# EAGLE design humanoid-16 (EAGLE 7.2.0)

## Sheet 1 of 10
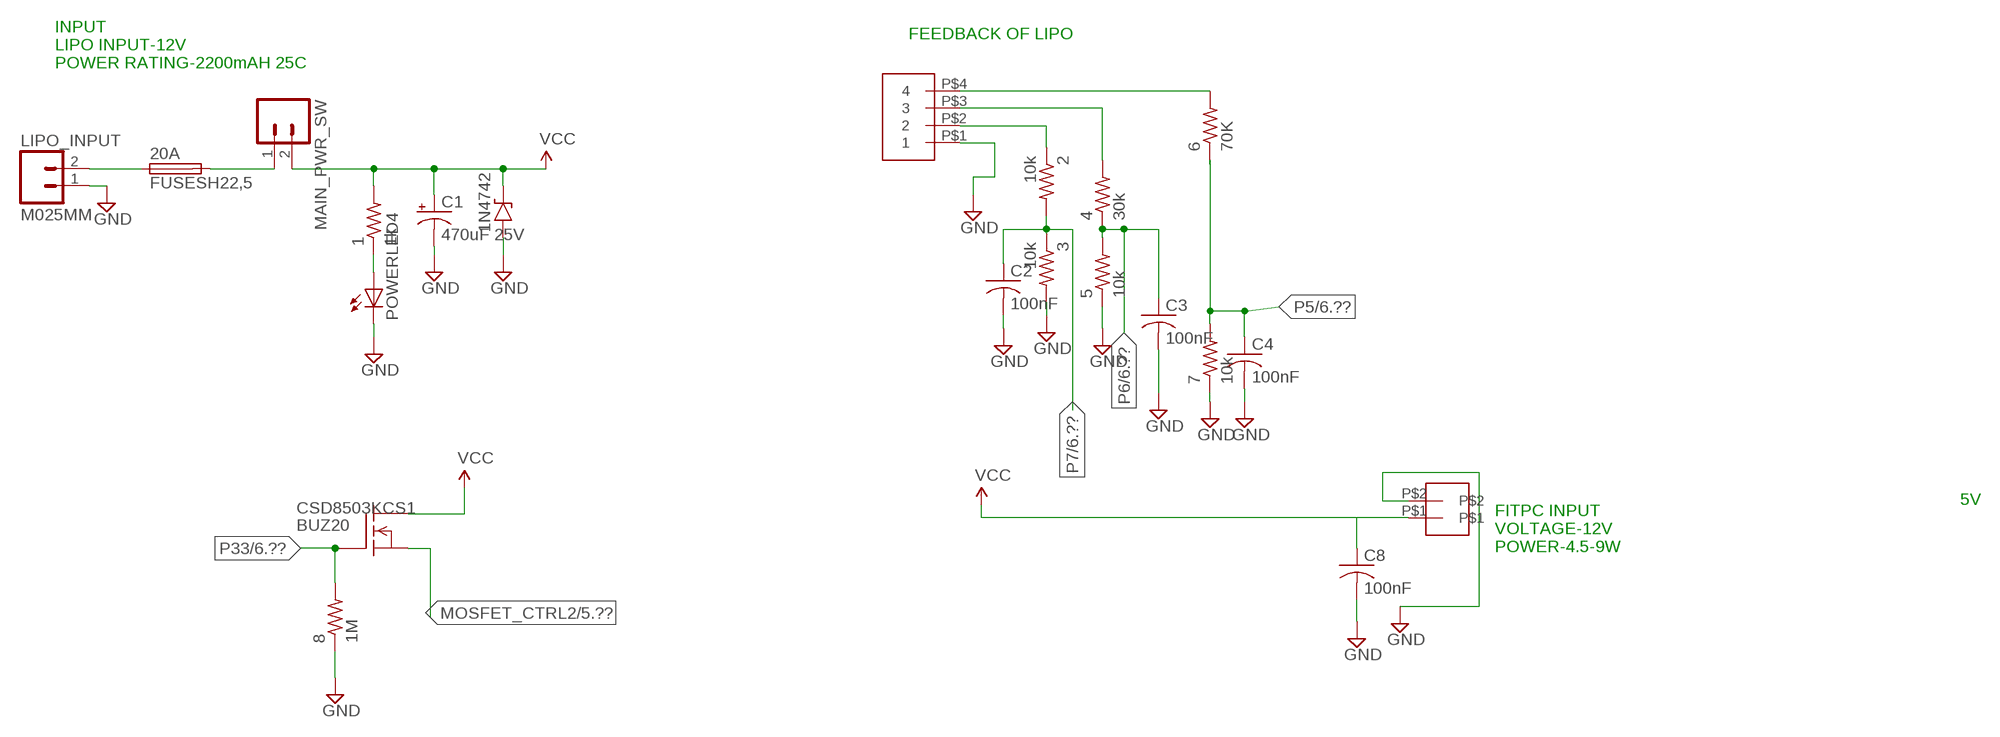
[diagram p0: schematic, sheet 1]

### Parts
1  1k  R-US_R0805  [R0805]
1N4742  1N47XX3  [DO41-3]
2  10k  R-US_R0805  [R0805]
3  10k  R-US_R0805  [R0805]
4  30k  R-US_R0805  [R0805]
5  10k  R-US_R0805  [R0805]
6  70K  R-US_R0805  [R0805]
7  10k  R-US_R0805  [R0805]
8  1M  R-US_R0805  [R0805]
20A  FUSESH22,5  [SH22,5]
C1  470uF 25V  CPOL-USG  [PANASONIC_G]
C2  100nF  C-USC1206  [C1206]
C3  100nF  C-USC1206  [C1206]
C4  100nF  C-USC1206  [C1206]
C8  100nF  C-USC1206  [C1206]
CSD8503KCS1  BUZ20  [TO220]
FITPC  2PINRIGHT  [2PINRIGHT]
LIPO_INPUT  M025MM  [SCREWTERMINAL-5MM-2]
MAIN_PWR_SW  M02PTH  [1X02]
POWERLED4  LEDCHIPLED_1206  [CHIPLED_1206]
U$2  4PINRIGHT  [4PINRIGHT]

### Nets
GND: 1N4742.A 3.2 5.1 7.1 8.1 C1.- C2.2 C3.2 C4.2 C8.2 FITPC.P$2 LIPO_INPUT.1 POWERLED4.C U$2.P$1 ; also sheet 2,3,5,6,7,8,10
LIPO_FB4: 6.2 U$2.P$4
MOSFET_CTRL2: CSD8503KCS1.3(S) ; also sheet 5
N$4: 2.1 U$2.P$2
N$9: 20A.2 MAIN_PWR_SW.1
N$14: 20A.1 LIPO_INPUT.2
N$338: 4.2 U$2.P$3
N$381: 1.1 POWERLED4.A
P5: 6.1 7.2 C4.1 ; also sheet 6
P6: 4.1 5.2 C3.1 ; also sheet 6
P7: 2.2 3.1 C2.1 ; also sheet 6
P33: 8.2 CSD8503KCS1.1(G) ; also sheet 6
VCC: 1.2 1N4742.C C1.+ C8.1 CSD8503KCS1.2(D) FITPC.P$1 MAIN_PWR_SW.2 ; also sheet 3

### Notes on the sheet
- FEEDBACK OF LIPO
- INPUT
  LIPO INPUT-12V
  POWER RATING-2200mAH 25C
- 5V
- FITPC INPUT
  VOLTAGE-12V
  POWER-4.5-9W

## Sheet 2 of 10
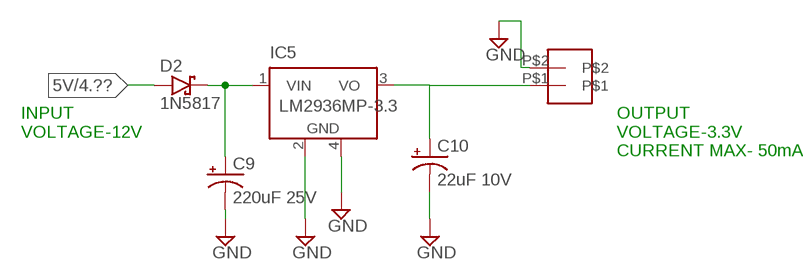
[diagram p1: schematic, sheet 2]

### Parts
3.3V1  2PINRIGHT  [2PINRIGHT]
C9  220uF 25V  CPOL-USG  [PANASONIC_G]
C10  22uF 10V  CPOL-USB  [PANASONIC_B]
D2  1N5817  [DO41-3]
IC5  LM2936MP-3.3  [SOT223]

### Nets
3.3V: 3.3V1.P$1 C10.+ IC5.3(VO) ; also sheet 4,6,7,10
5V: D2.A ; also sheet 3,4,6,7,8
GND: 3.3V1.P$2 C9.- C10.- IC5.2(GND) IC5.4(GND) ; also sheet 1,3,5,6,7,8,10
N$3: C9.+ D2.C IC5.1(VIN)

### Notes on the sheet
- INPUT
  VOLTAGE-12V
- OUTPUT
  VOLTAGE-3.3V
  CURRENT MAX- 50mA

## Sheet 3 of 10
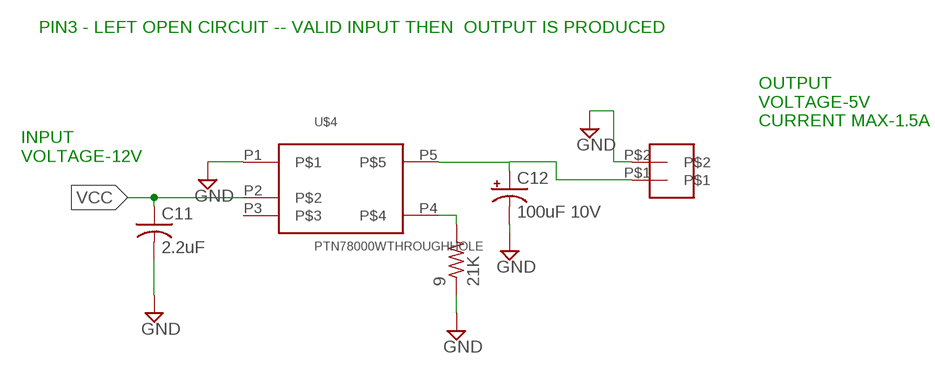
[diagram p2: schematic, sheet 3]

### Parts
5V1  2PINRIGHT  [2PINRIGHT]
9  21K  R-US_R0805  [R0805]
C11  2.2uF  C-USC1206  [C1206]
C12  100uF 10V  CPOL-USE  [PANASONIC_E]
U$4  PTN78000WTHROUGHHOLE  [PTN78000W]

### Nets
5V: 5V1.P$1 C12.+ U$4.P5 ; also sheet 2,4,6,7,8
GND: 5V1.P$2 9.1 C11.2 C12.- U$4.P1 ; also sheet 1,2,5,6,7,8,10
N$76: 9.2 U$4.P4
VCC: C11.1 U$4.P2 ; also sheet 1
Unconnected: U$4.P3

### Notes on the sheet
- PIN3 - LEFT OPEN CIRCUIT -- VALID INPUT THEN  OUTPUT IS PRODUCED
- OUTPUT
  VOLTAGE-5V
  CURRENT MAX-1.5A
- INPUT
  VOLTAGE-12V

## Sheet 4 of 10
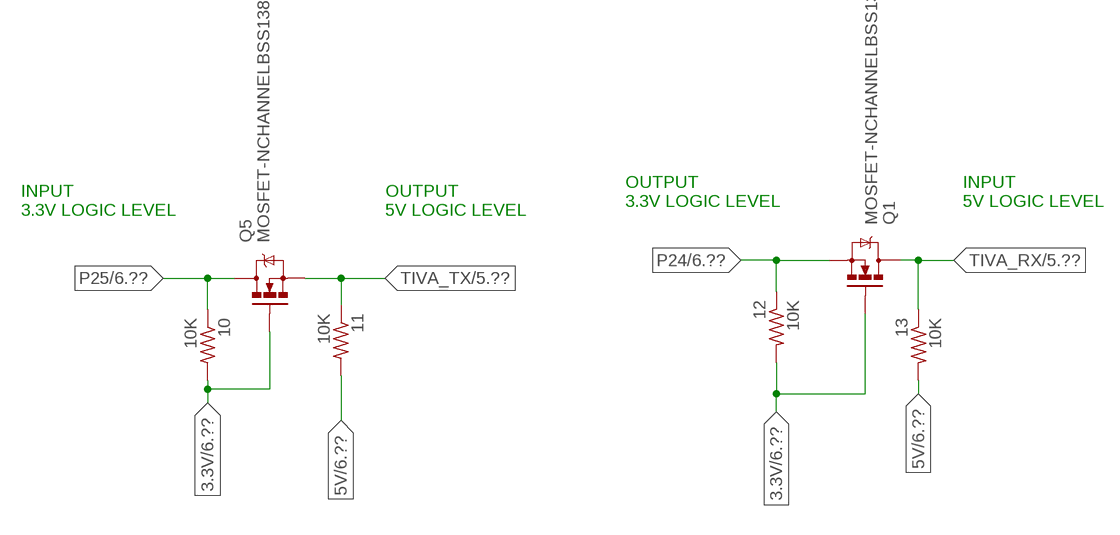
[diagram p3: schematic, sheet 4]

### Parts
10  10K  R-US_R0805  [R0805]
11  10K  R-US_R0805  [R0805]
12  10K  R-US_R0805  [R0805]
13  10K  R-US_R0805  [R0805]
Q1  MOSFET-NCHANNELBSS138  [SOT23]
Q5  MOSFET-NCHANNELBSS138  [SOT23]

### Nets
3.3V: 10.2 12.2 Q1.1(G) Q5.1(G) ; also sheet 2,6,7,10
5V: 11.2 13.2 ; also sheet 2,3,6,7,8
P24: 12.1 Q1.2(S) ; also sheet 6
P25: 10.1 Q5.3(D) ; also sheet 6
TIVA_RX: 13.1 Q1.3(D) ; also sheet 5
TIVA_TX: 11.1 Q5.2(S) ; also sheet 5

### Notes on the sheet
- OUTPUT
  3.3V LOGIC LEVEL
- INPUT
  5V LOGIC LEVEL
- INPUT
  3.3V LOGIC LEVEL
- OUTPUT
  5V LOGIC LEVEL

## Sheet 5 of 10
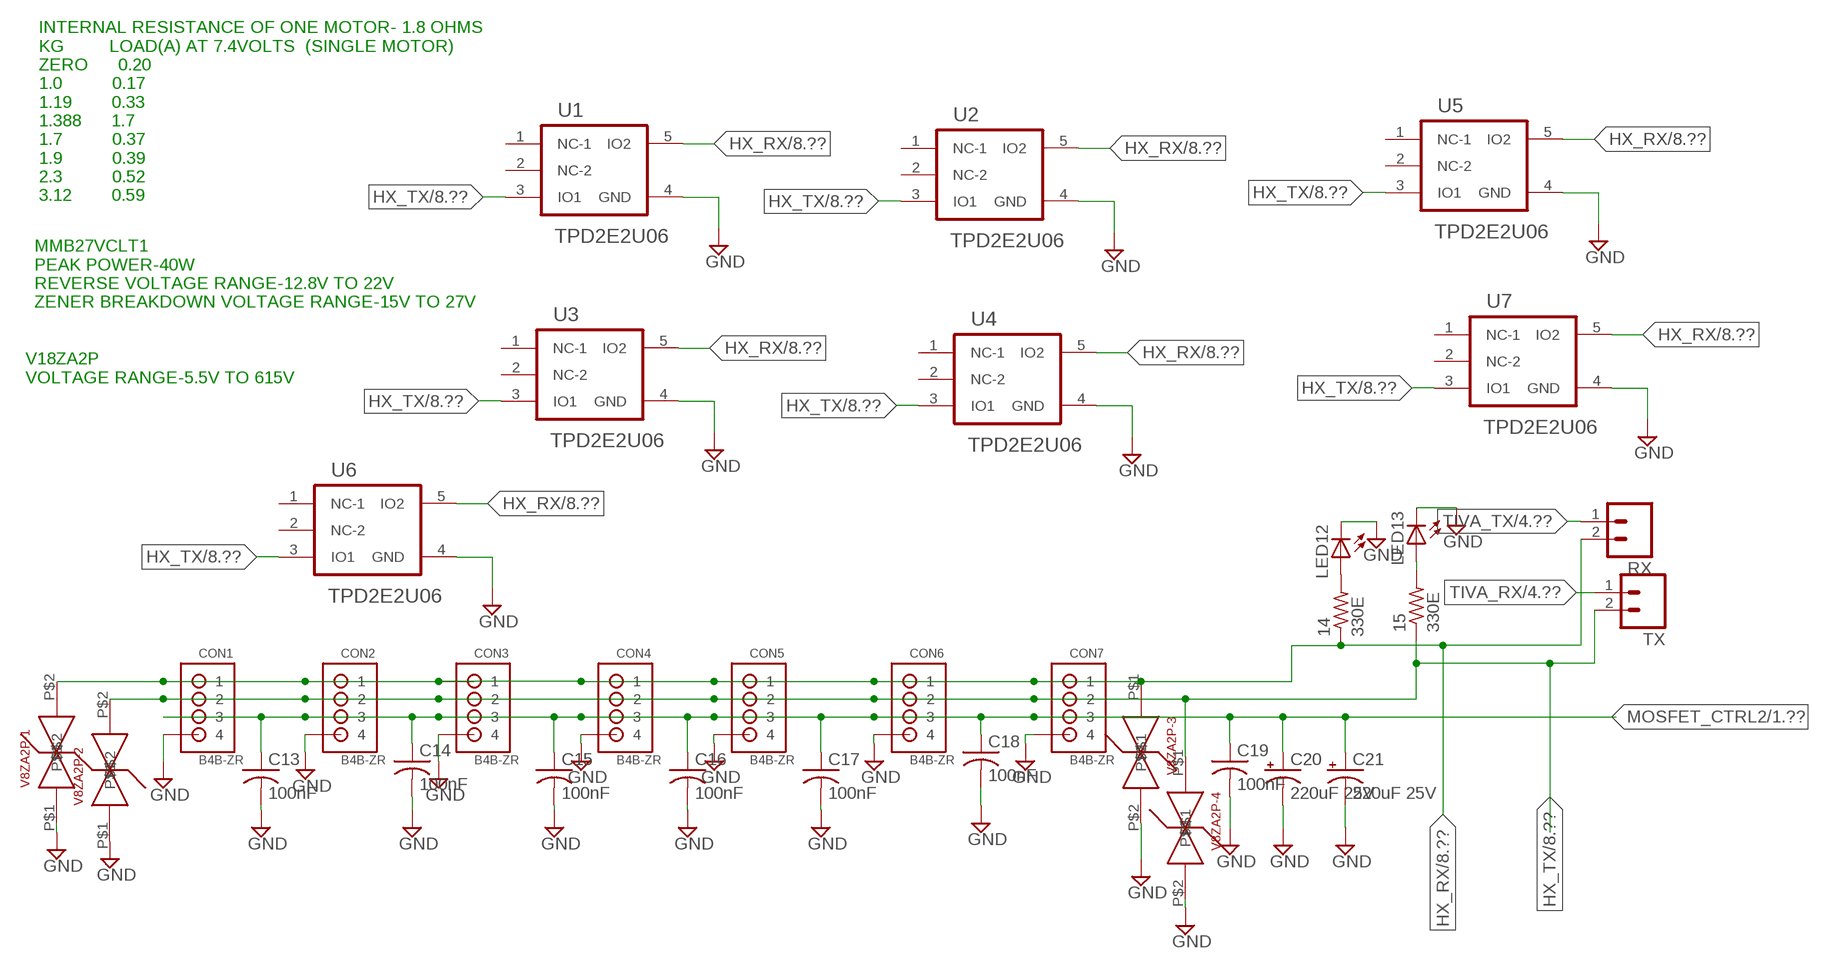
[diagram p4: schematic, sheet 5]

### Parts
14  330E  R-US_R0805  [R0805]
15  330E  R-US_R0805  [R0805]
C13  100nF  C-USC1206  [C1206]
C14  100nF  C-USC1206  [C1206]
C15  100nF  C-USC1206  [C1206]
C16  100nF  C-USC1206  [C1206]
C17  100nF  C-USC1206  [C1206]
C18  100nF  C-USC1206  [C1206]
C19  100nF  C-USC1206  [C1206]
C20  220uF 25V  CPOL-USG  [PANASONIC_G]
C21  220uF 25V  CPOL-USG  [PANASONIC_G]
CON1  B4B-ZR  [B4B-ZR]
CON2  B4B-ZR  [B4B-ZR]
CON3  B4B-ZR  [B4B-ZR]
CON4  B4B-ZR  [B4B-ZR]
CON5  B4B-ZR  [B4B-ZR]
CON6  B4B-ZR  [B4B-ZR]
CON7  B4B-ZR  [B4B-ZR]
LED12  LEDCHIPLED_1206  [CHIPLED_1206]
LED13  LEDCHIPLED_1206  [CHIPLED_1206]
RX  M02PTH  [1X02]
TX  M02PTH  [1X02]
U1  TPD2E2U06  [SOT50P160X60-5N]
U2  TPD2E2U06  [SOT50P160X60-5N]
U3  TPD2E2U06  [SOT50P160X60-5N]
U4  TPD2E2U06  [SOT50P160X60-5N]
U5  TPD2E2U06  [SOT50P160X60-5N]
U6  TPD2E2U06  [SOT50P160X60-5N]
U7  TPD2E2U06  [SOT50P160X60-5N]
V8ZA2P-1  V18ZA2P  [V18ZA2P]
V8ZA2P-2  V18ZA2P  [V18ZA2P]
V8ZA2P-3  V18ZA2P  [V18ZA2P]
V8ZA2P-4  V18ZA2P  [V18ZA2P]

### Nets
GND: C13.2 C14.2 C15.2 C16.2 C17.2 C18.2 C19.2 C20.- C21.- CON1.4 CON2.4 CON3.4 CON4.4 CON5.4 CON6.4 CON7.4 LED12.C LED13.C U1.4(GND) U2.4(GND) U3.4(GND) U4.4(GND) U5.4(GND) U6.4(GND) U7.4(GND) V8ZA2P-1.P$1 V8ZA2P-2.P$1 V8ZA2P-3.P$2 V8ZA2P-4.P$2 ; also sheet 1,2,3,6,7,8,10
HX_RX: 14.1 CON1.1 CON2.1 CON3.1 CON4.1 CON5.1 CON6.1 CON7.1 RX.2 U1.5(IO2) U2.5(IO2) U3.5(IO2) U4.5(IO2) U5.5(IO2) U6.5(IO2) U7.5(IO2) V8ZA2P-1.P$2 V8ZA2P-3.P$1 ; also sheet 8
HX_TX: 15.1 CON1.2 CON2.2 CON3.2 CON4.2 CON5.2 CON6.2 CON7.2 TX.2 U1.3(IO1) U2.3(IO1) U3.3(IO1) U4.3(IO1) U5.3(IO1) U6.3(IO1) U7.3(IO1) V8ZA2P-2.P$2 V8ZA2P-4.P$1 ; also sheet 8
MOSFET_CTRL2: C13.1 C14.1 C15.1 C16.1 C17.1 C18.1 C19.1 C20.+ C21.+ CON1.3 CON2.3 CON3.3 CON4.3 CON5.3 CON6.3 CON7.3 ; also sheet 1
N$73: 14.2 LED12.A
N$74: 15.2 LED13.A
TIVA_RX: TX.1 ; also sheet 4
TIVA_TX: RX.1 ; also sheet 4
Unconnected: U1.1(NC-1) U1.2(NC-2) U2.1(NC-1) U2.2(NC-2) U3.1(NC-1) U3.2(NC-2) U4.1(NC-1) U4.2(NC-2) U5.1(NC-1) U5.2(NC-2) U6.1(NC-1) U6.2(NC-2) U7.1(NC-1) U7.2(NC-2)

### Notes on the sheet
- INTERNAL RESISTANCE OF ONE MOTOR- 1.8 OHMS
  KG         LOAD(A) AT 7.4VOLTS  (SINGLE MOTOR)
  ZERO      0.20
  1.0          0.17
  1.19        0.33
  1.388      1.7
  1.7          0.37
  1.9          0.39
  2.3          0.52
  3.12        0.59
- MMB27VCLT1
  PEAK POWER-40W
  REVERSE VOLTAGE RANGE-12.8V TO 22V
  ZENER BREAKDOWN VOLTAGE RANGE-15V TO 27V
- V18ZA2P
  VOLTAGE RANGE-5.5V TO 615V

## Sheet 6 of 10
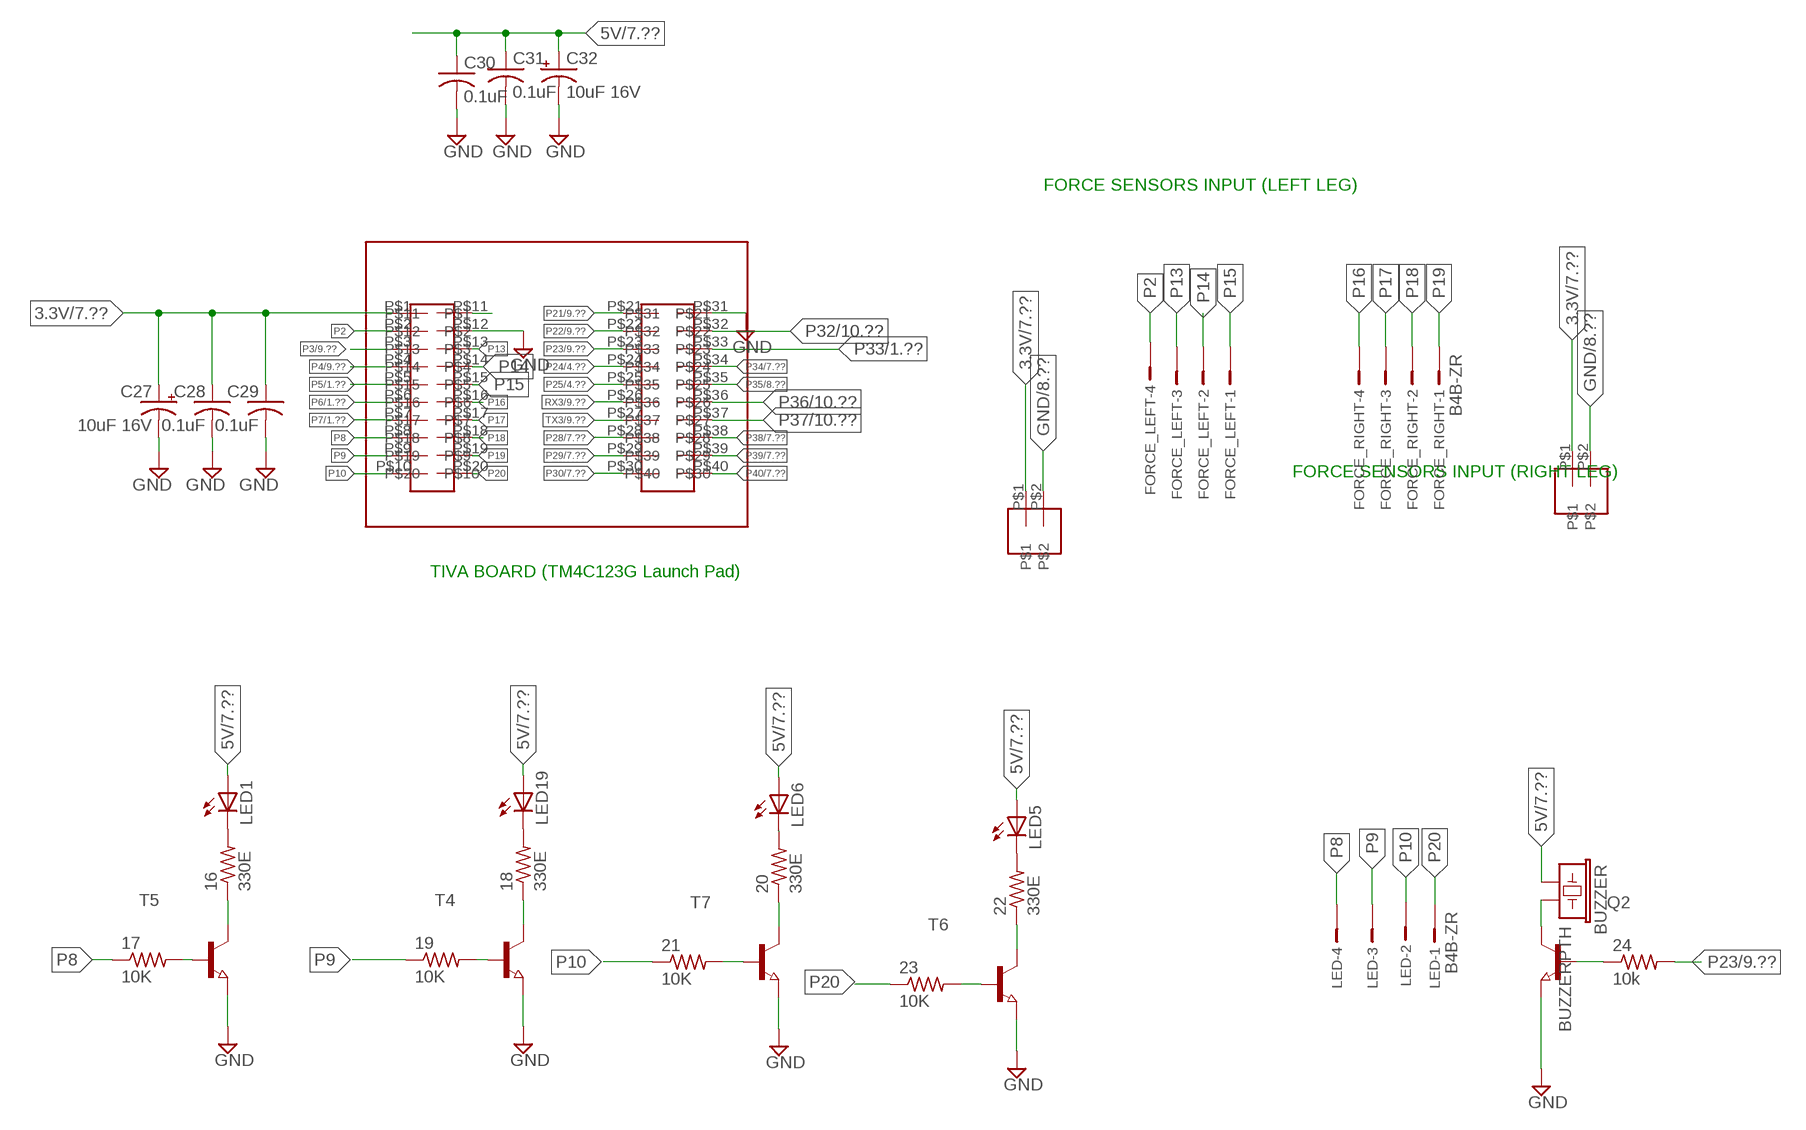
[diagram p5: schematic, sheet 6]

### Parts
3.3VL  2PINRIGHT  [2PINRIGHT]
3.3VR  2PINRIGHT  [2PINRIGHT]
16  330E  R-US_R0805  [R0805]
17  10K  R-US_R0805  [R0805]
18  330E  R-US_R0805  [R0805]
19  10K  R-US_R0805  [R0805]
20  330E  R-US_R0805  [R0805]
21  10K  R-US_R0805  [R0805]
22  330E  R-US_R0805  [R0805]
23  10K  R-US_R0805  [R0805]
24  10k  R-US_R0805  [R0805]
BUZZER  BUZZERPTH  [BUZZER-12MM]
C27  10uF 16V  CPOL-USB  [PANASONIC_B]
C28  0.1uF  C-USC1206  [C1206]
C29  0.1uF  C-USC1206  [C1206]
C30  0.1uF  C-USC1206  [C1206]
C31  0.1uF  C-USC1206  [C1206]
C32  10uF 16V  CPOL-USB  [PANASONIC_B]
FORCE_LEFT  B4B-ZR  [B4B-ZR]
FORCE_RIGHT  B4B-ZR  [B4B-ZR]
LED  B4B-ZR  [B4B-ZR]
LED1  LEDCHIPLED_1206  [CHIPLED_1206]
LED5  LEDCHIPLED_1206  [CHIPLED_1206]
LED6  LEDCHIPLED_1206  [CHIPLED_1206]
LED19  LEDCHIPLED_1206  [CHIPLED_1206]
Q2  NPN-TRANSISTOR_SOT23  [SOT23]
T4  NPN-TRANSISTOR_SOT23  [SOT23]
T5  NPN-TRANSISTOR_SOT23  [SOT23]
T6  NPN-TRANSISTOR_SOT23  [SOT23]
T7  NPN-TRANSISTOR_SOT23  [SOT23]
U$1  TIVA  [TIVA]

### Nets
3.3V: 3.3VL.P$1 3.3VR.P$1 C27.+ C28.1 C29.1 U$1.P$1 ; also sheet 2,4,7,10
5V: BUZZER.+ C30.1 C31.1 C32.+ LED1.A LED5.A LED6.A LED19.A U$1.P$11 ; also sheet 2,3,4,7,8
GND: 3.3VL.P$2 3.3VR.P$2 C27.- C28.2 C29.2 C30.2 C31.2 C32.- Q2.2(E) T4.2(E) T5.2(E) T6.2(E) T7.2(E) U$1.P$12 U$1.P$31 ; also sheet 1,2,3,5,7,8,10
N$20: BUZZER.- Q2.3(C)
N$21: 24.1 Q2.1(B)
N$22: 19.2 T4.1(B)
N$24: 18.2 LED19.C
N$25: 18.1 T4.3(C)
N$26: 17.2 T5.1(B)
N$32: 16.2 LED1.C
N$33: 16.1 T5.3(C)
N$36: 23.2 T6.1(B)
N$40: 22.2 LED5.C
N$41: 22.1 T6.3(C)
N$42: 21.2 T7.1(B)
N$43: 20.2 LED6.C
N$44: 20.1 T7.3(C)
P2: FORCE_LEFT.4 U$1.P$2
P3: U$1.P$3 ; also sheet 9
P4: U$1.P$4 ; also sheet 9
P5: U$1.P$5 ; also sheet 1
P6: U$1.P$6 ; also sheet 1
P7: U$1.P$7 ; also sheet 1
P8: 17.1 LED.4 U$1.P$8
P9: 19.1 LED.3 U$1.P$9
P10: 21.1 LED.2 U$1.P$10
P13: FORCE_LEFT.3 U$1.P$13
P14: FORCE_LEFT.2 U$1.P$14
P15: FORCE_LEFT.1 U$1.P$15
P16: FORCE_RIGHT.4 U$1.P$16
P17: FORCE_RIGHT.3 U$1.P$17
P18: FORCE_RIGHT.2 U$1.P$18
P19: FORCE_RIGHT.1 U$1.P$19
P20: 23.1 LED.1 U$1.P$20
P21: U$1.P$21 ; also sheet 9
P22: U$1.P$22 ; also sheet 9
P23: 24.2 U$1.P$23 ; also sheet 9
P24: U$1.P$24 ; also sheet 4
P25: U$1.P$25 ; also sheet 4
P28: U$1.P$28 ; also sheet 7
P29: U$1.P$29 ; also sheet 7
P30: U$1.P$30 ; also sheet 7
P32: U$1.P$32 ; also sheet 10
P33: U$1.P$33 ; also sheet 1
P34: U$1.P$34 ; also sheet 7
P35: U$1.P$35 ; also sheet 8
P36: U$1.P$36 ; also sheet 10
P37: U$1.P$37 ; also sheet 10
P38: U$1.P$38 ; also sheet 7
P39: U$1.P$39 ; also sheet 7
P40: U$1.P$40 ; also sheet 7
RX3: U$1.P$26 ; also sheet 9
TX3: U$1.P$27 ; also sheet 9

### Notes on the sheet
- FORCE SENSORS INPUT (LEFT LEG)
- FORCE SENSORS INPUT (RIGHT LEG)
- TIVA BOARD (TM4C123G Launch Pad)

## Sheet 7 of 10
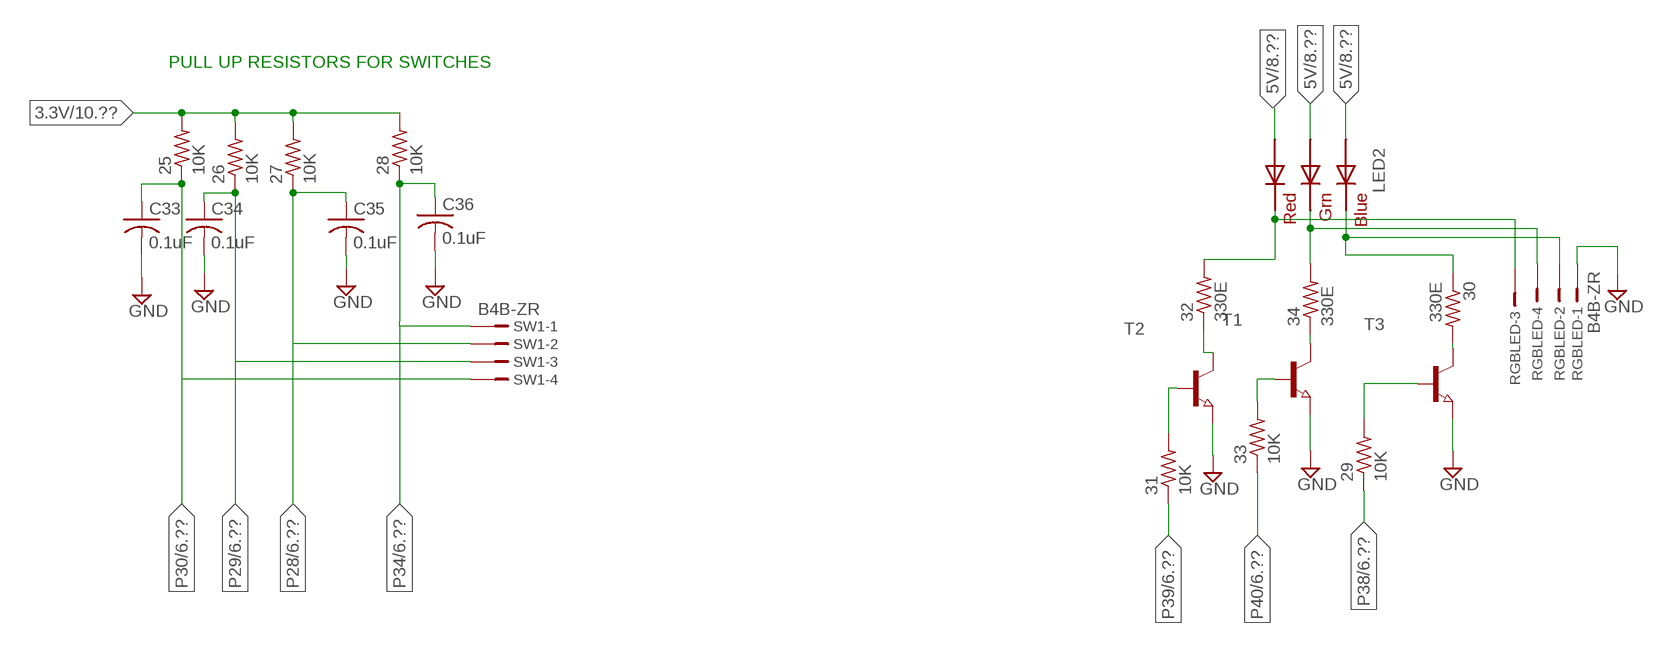
[diagram p6: schematic, sheet 7]

### Parts
25  10K  R-US_R0805  [R0805]
26  10K  R-US_R0805  [R0805]
27  10K  R-US_R0805  [R0805]
28  10K  R-US_R0805  [R0805]
29  10K  R-US_R0805  [R0805]
30  330E  R-US_R0805  [R0805]
31  10K  R-US_R0805  [R0805]
32  330E  R-US_R0805  [R0805]
33  10K  R-US_R0805  [R0805]
34  330E  R-US_R0805  [R0805]
C33  0.1uF  C-USC1206  [C1206]
C34  0.1uF  C-USC1206  [C1206]
C35  0.1uF  C-USC1206  [C1206]
C36  0.1uF  C-USC1206  [C1206]
LED2  RGBLED5050  [RGBLED5050]
RGBLED  B4B-ZR  [B4B-ZR]
SW1  B4B-ZR  [B4B-ZR]
T1  NPN-TRANSISTOR_SOT23  [SOT23]
T2  NPN-TRANSISTOR_SOT23  [SOT23]
T3  NPN-TRANSISTOR_SOT23  [SOT23]

### Nets
3.3V: 25.2 26.2 27.2 28.2 ; also sheet 2,4,6,10
5V: LED2.1(GREEN_A) LED2.2(RED_A) LED2.3(BLUE_A) ; also sheet 2,3,4,6,8
GND: C33.2 C34.2 C35.2 C36.2 RGBLED.1 T1.2(E) T2.2(E) T3.2(E) ; also sheet 1,2,3,5,6,8,10
N$1: 30.1 LED2.4(BLUE_C) RGBLED.2
N$5: 32.2 LED2.5(RED_C) RGBLED.3
N$27: 34.2 LED2.6(GREEN_C) RGBLED.4
N$29: 30.2 T3.3(C)
N$30: 32.1 T2.3(C)
N$31: 34.1 T1.3(C)
N$37: 29.2 T3.1(B)
N$38: 31.2 T2.1(B)
N$39: 33.2 T1.1(B)
P28: 27.1 C35.1 SW1.2 ; also sheet 6
P29: 26.1 C34.1 SW1.3 ; also sheet 6
P30: 25.1 C33.1 SW1.4 ; also sheet 6
P34: 28.1 C36.1 SW1.1 ; also sheet 6
P38: 29.1 ; also sheet 6
P39: 31.1 ; also sheet 6
P40: 33.1 ; also sheet 6

### Notes on the sheet
- PULL UP RESISTORS FOR SWITCHES

## Sheet 8 of 10
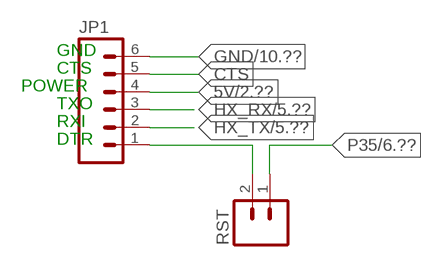
[diagram p7: schematic, sheet 8]

### Parts
JP1  M06LOCK  [1X06_LOCK]
RST  M02PTH  [1X02]

### Nets
5V: JP1.4 ; also sheet 2,3,4,6,7
CTS: JP1.5
GND: JP1.6 ; also sheet 1,2,3,5,6,7,10
HX_RX: JP1.3 ; also sheet 5
HX_TX: JP1.2 ; also sheet 5
N$2: JP1.1 RST.2
P35: RST.1 ; also sheet 6

### Notes on the sheet
- GND
- CTS
- POWER
- TXO
- RXI
- DTR

## Sheet 9 of 10
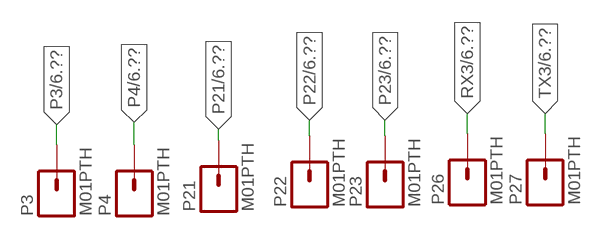
[diagram p8: schematic, sheet 9]

### Parts
P3  M01PTH  [1X01]
P4  M01PTH  [1X01]
P21  M01PTH  [1X01]
P22  M01PTH  [1X01]
P23  M01PTH  [1X01]
P26  M01PTH  [1X01]
P27  M01PTH  [1X01]

### Nets
P3: P3.1 ; also sheet 6
P4: P4.1 ; also sheet 6
P21: P21.1 ; also sheet 6
P22: P22.1 ; also sheet 6
P23: P23.1 ; also sheet 6
RX3: P26.1 ; also sheet 6
TX3: P27.1 ; also sheet 6

## Sheet 10 of 10
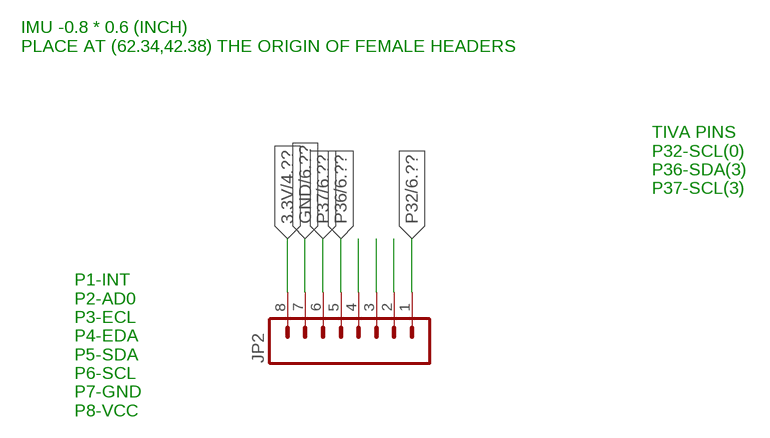
[diagram p9: schematic, sheet 10]

### Parts
JP2  M081X08  [1X08]

### Nets
3.3V: JP2.8 ; also sheet 2,4,6,7
GND: JP2.7 ; also sheet 1,2,3,5,6,7,8
N$12: JP2.4
N$13: JP2.3
N$15: JP2.2
P32: JP2.1 ; also sheet 6
P36: JP2.5 ; also sheet 6
P37: JP2.6 ; also sheet 6

### Notes on the sheet
- IMU -0.8 * 0.6 (INCH)
  PLACE AT (62.34,42.38) THE ORIGIN OF FEMALE HEADERS
- TIVA PINS
  P32-SCL(0)
  P36-SDA(3)
  P37-SCL(3)
- P1-INT
  P2-AD0
  P3-ECL
  P4-EDA
  P5-SDA
  P6-SCL
  P7-GND
  P8-VCC

## Library data of the parts
1-23 25-34 = resistor:R-US_: RESISTOR, American symbol; OC_NEWARK: unknown
1N4742 = gm-diodes:1N47XX: Zener Diode 1N4728 - 1N4764: 3.3 V - 100V, 10% (1n47xxA 5%); DO-41 glass case; OC_NEWARK: unknown
3.3V1 5V1 FITPC = jst 2.5mm:2PINRIGHT; OC_NEWARK: unknown
3.3VL 3.3VR = jst 2.5mm:2PINRIGHT
20A = fuse:FUSE: Fuse; OC_FARNELL: unknown; OC_NEWARK: unknown
24 = resistor:R-US_: RESISTOR, American symbol
BUZZER = SparkFun-Electromechanical:BUZZER: Buzzer 12mm Spark Fun Electronics SKU : Comp-Buzzer
C1 = resistor:CPOL-US: POLARIZED CAPACITOR, American symbol; MANUFACTURER: PANASONIC ELECTRONIC COMPONENTS; OC_NEWARK: unknown; PARTNO: EEEFK1E471AP
C2-C4 C8 C13-C19 = adafruit:C-US: CAPACITOR, American symbol; MANUFACTURER: KEMET; OC_NEWARK: unknown; PARTNO: C1206C104K5RACTU
C9 C20 C21 = resistor:CPOL-US: POLARIZED CAPACITOR, American symbol; MANUFACTURER: PANASONIC ELECTRONIC COMPONENTS; MOUSER_PARTNO: 667-EEE-1EA221P; OC_NEWARK: unknown; PARTNO: EEE-1EA221P; SELLER: MOUSER ELECTRONICS
C10 = resistor:CPOL-US: POLARIZED CAPACITOR, American symbol; MANUFACTURER: PANASONIC ELECTRONIC COMPONENTS; OC_NEWARK: unknown; PARTNO: EEEFK1A220AR
C11 = resistor:C-US: CAPACITOR, American symbol; MANUFACTURER: TDK; MOUSER_PARTNO: 810-C1608X7R1A225K; PARTNO: C1608X7R1A225K080AC; SELLER: MOUSER
C12 = resistor:CPOL-US: POLARIZED CAPACITOR, American symbol; MANUFACTURER: Panasonic; MOUSER_PARTNO: 667-EEE-HA1A101P; OC_NEWARK: unknown; PARTNO: EEE-HA1A101P; SELLER: MOUSER ELECTRONICS
C27 C32 = resistor:CPOL-US: POLARIZED CAPACITOR, American symbol
C28-C31 = resistor:C-US: CAPACITOR, American symbol
C33-C36 = adafruit:C-US: CAPACITOR, American symbol; MANUFACTURER: Kemet; MOUSER_PARTNO: 80-C0805C104M5R; OC_NEWARK: unknown; PARTNO: C0805C104M5RACTU; SELLER: MOUSER
CON1-CON7 = jst_herkulex:B4B-ZR: JST-ZH Connector 4 pol, 1.5mm pitch Package: B4B-ZR Source: http://www.jst-mfg.com/product/pdf/eng/eZH.pdf; MF: FARNELL; MPN: B4B-ZR(LF)(SN); OC_NEWARK: unknown
CSD8503KCS1 = transistor-fet:BUZ20: N-Channel Enhancement MOSFET 100V; 12A; 0,2Ohm; OC_NEWARK: unknown
D2 = gm-diodes:1N5817; OC_NEWARK: unknown
FORCE_LEFT FORCE_RIGHT LED RGBLED SW1 = con-jst:?4B-ZR: ZH CONNECTOR 1.5 mm, 4 pin 1 row Source: http://www.jst.com .. eZH.pdf; MF: FARNELL; MPN: B4B-ZR(LF)(SN); OC_FARNELL: 1830916; OC_NEWARK: unknown
IC5 = national-semiconductor:LM2936MP?*: Ultra-Low Quiescent Current LDO Voltage Regulator Source: Data sheet <http://www.national.com/ds/LM/LM2936.pdf>; MF: NATIONAL SEMICONDUCTOR; MPN: LM2936MP-3.3/NOPB; OC_FARNELL: 1469062; OC_NEWARK: unknown
JP1 = SparkFun-Connectors:M06: Header 6 Standard 6-pin 0.1" header. Use with straight break away headers (SKU : PRT-00116), right angle break away headers (PRT-00553), swiss pins (PRT-00743), machine pins (PRT-00117), and female headers (PRT-00115). Molex polarized connector foot print use with SKU : PRT-08094 with associated crimp pins and housings. NOTES ON THE VARIANTS LOCK and LOCK_LONGPADS... This footprint was designed to help hold the alignment of a through-hole component (i.e. 6-pin header) while soldering it into place. You may notice that each hole has been shifted either up or down by 0.005 of an inch from it's more standard position (which is a perfectly straight line). This slight alteration caused the pins (the squares in the middle) to touch the edges of the holes. Because they are alternating, it causes a "brace" to hold the component in place. 0.005 has proven to be the perfect amount of "off-center" position when using our standard breakaway headers. Although looks a little odd when you look at the bare footprint, once you have a header in there, the alteration is very hard to notice. Also,if you push a header all the way into place, it is covered up entirely on the bottom side. This idea of altering the position of holes to aid alignment will be further integrated into the Sparkfun Library for other footprints. It can help hold any component with 3 or more connection pins.
JP2 = SparkFun-Connectors:M08: Header 8 Standard 8-pin 0.1" header. Use with straight break away headers (SKU : PRT-00116), right angle break away headers (PRT-00553), swiss pins (PRT-00743), machine pins (PRT-00117), and female headers (PRT-00115).
LED1 LED5 LED6 LED12 LED13 LED19 POWERLED4 = adafruit:LED: LED OSRAM: - CHIPLED LG R971, LG N971, LY N971, LG Q971, LY Q971, LO R971, LY R971 LH N974, LH R974 LS Q976, LO Q976, LY Q976 LO Q996 - Hyper CHIPLED LW Q18S LB Q993, LB Q99A, LB R99A - SideLED LS A670, LO A670, LY A670, LG A670, LP A670 LB A673, LV A673, LT A673, LW A673 LH A674 LY A675 LS A676, LA A676, LO A676, LY A676, LW A676 LS A679, LY A679, LG A679 - Hyper Micro SIDELED® LS Y876, LA Y876, LO Y876, LY Y876 LT Y87S - SmartLED LW L88C, LW L88S LB L89C, LB L89S, LG L890 LS L89K, LO L89K, LY L89K LS L896, LA L896, LO L896, LY L896 - TOPLED LS T670, LO T670, LY T670, LG T670, LP T670 LSG T670, LSP T670, LSY T670, LOP T670, LYG T670 LG T671, LOG T671, LSG T671 LB T673, LV T673, LT T673, LW T673 LH T674 LS T676, LA T676, LO T676, LY T676, LB T676, LH T676, LSB T676, LW T676 LB T67C, LV T67C, LT T67C, LS T67K, LO T67K, LY T67K, LW E67C LS E67B, LA E67B, LO E67B, LY E67B, LB E67C, LV E67C, LT E67C LW T67C LS T679, LY T679, LG T679 LS T770, LO T770, LY T770, LG T770, LP T770 LB T773, LV T773, LT T773, LW T773 LH T774 LS E675, LA E675, LY E675, LS T675 LS T776, LA T776, LO T776, LY T776, LB T776 LHGB T686 LT T68C, LB T68C - Hyper Mini TOPLED® LB M676 - Mini TOPLED Santana® LG M470 LS M47K, LO M47K, LY M47K Source: http://www.osram.convergy.de/; OC_NEWARK: unknown
LED2 = adafruit:RGBLED: For 5050 RGB LEDs, the order of the LEDs may vary from one manufacturer to another!; OC_NEWARK: unknown
LIPO_INPUT = SparkFun-Connectors:M02: Standard 2-pin 0.1" header. Use with - straight break away headers ( PRT-00116) - right angle break away headers (PRT-00553) - swiss pins (PRT-00743) - machine pins (PRT-00117) - female headers (PRT-00115) Molex polarized connector foot print use with: PRT-08233 with associated crimp pins and housings. 2.54_SCREWTERM for use with PRT-10571. 3.5mm Screw Terminal footprints for PRT-08084 5mm Screw Terminal footprints for use with PRT-08433; OC_NEWARK: unknown
MAIN_PWR_SW RST RX TX = SparkFun:M02: Header 2 Standard 2-pin 0.1" header. Use with straight break away headers (SKU : PRT-00116), right angle break away headers (PRT-00553), swiss pins (PRT-00743), machine pins (PRT-00117), and female headers (PRT-00115). Molex polarized connector foot print use with SKU : PRT-08233 with associated crimp pins and housings.; OC_NEWARK: unknown
P3 P4 P21-P23 P26 P27 = SparkFun-Connectors:M01: Header 1 Standard 1-pin 0.1" header. Use with straight break away headers (SKU : PRT-00116), right angle break away headers (PRT-00553), swiss pins (PRT-00743), machine pins (PRT-00117), and female headers (PRT-00115).
Q1 Q5 = SparkFun-DiscreteSemi:MOSFET-NCHANNEL: Common NMOSFET Parts MFG P/N Store ID Prod ID FDD8780 TRANS-09984 SI7820DN TRANS-11055 FDS6630A IC-08089 2N7002PW TRANS-11151 FQP30N06L COM-10213 TRANS-10060 BSS123LT1G TRANS-08345 BSS138 TRANS-00830 BS170 2N7000; OC_NEWARK: unknown; PROD_ID: TRANS-00830
Q2 = semicon-smd-ipc:NPN-TRANSISTOR_: NPN TRANSISTOR
T1-T7 = semicon-smd-ipc:NPN-TRANSISTOR_: NPN TRANSISTOR; OC_NEWARK: unknown
U1-U7 = ti_tpd2e2u06:TPD2E2U06: LOW-CAPACITANCE 2-CHANNEL ±15-kV ESD-PROTECTION ARRAY; MPN: TPD2E001IDRLRQ1; OC_FARNELL: -; OC_NEWARK: 55R7553; PACKAGE: SOT-23-5; SUPPLIER: Texas Instruments
U$1 = tiva:TIVA; OC_NEWARK: unknown
U$2 = jst 2.5mm:4PINRIGHT
U$4 = PTN78000W:PTN78000W
V8ZA2P-1-V8ZA2P-4 = SparkFun-DiscreteSemi:V18ZA2P: Varistor; OC_NEWARK: unknown

## Net classes
0 default: width 0.35 mm

## Board
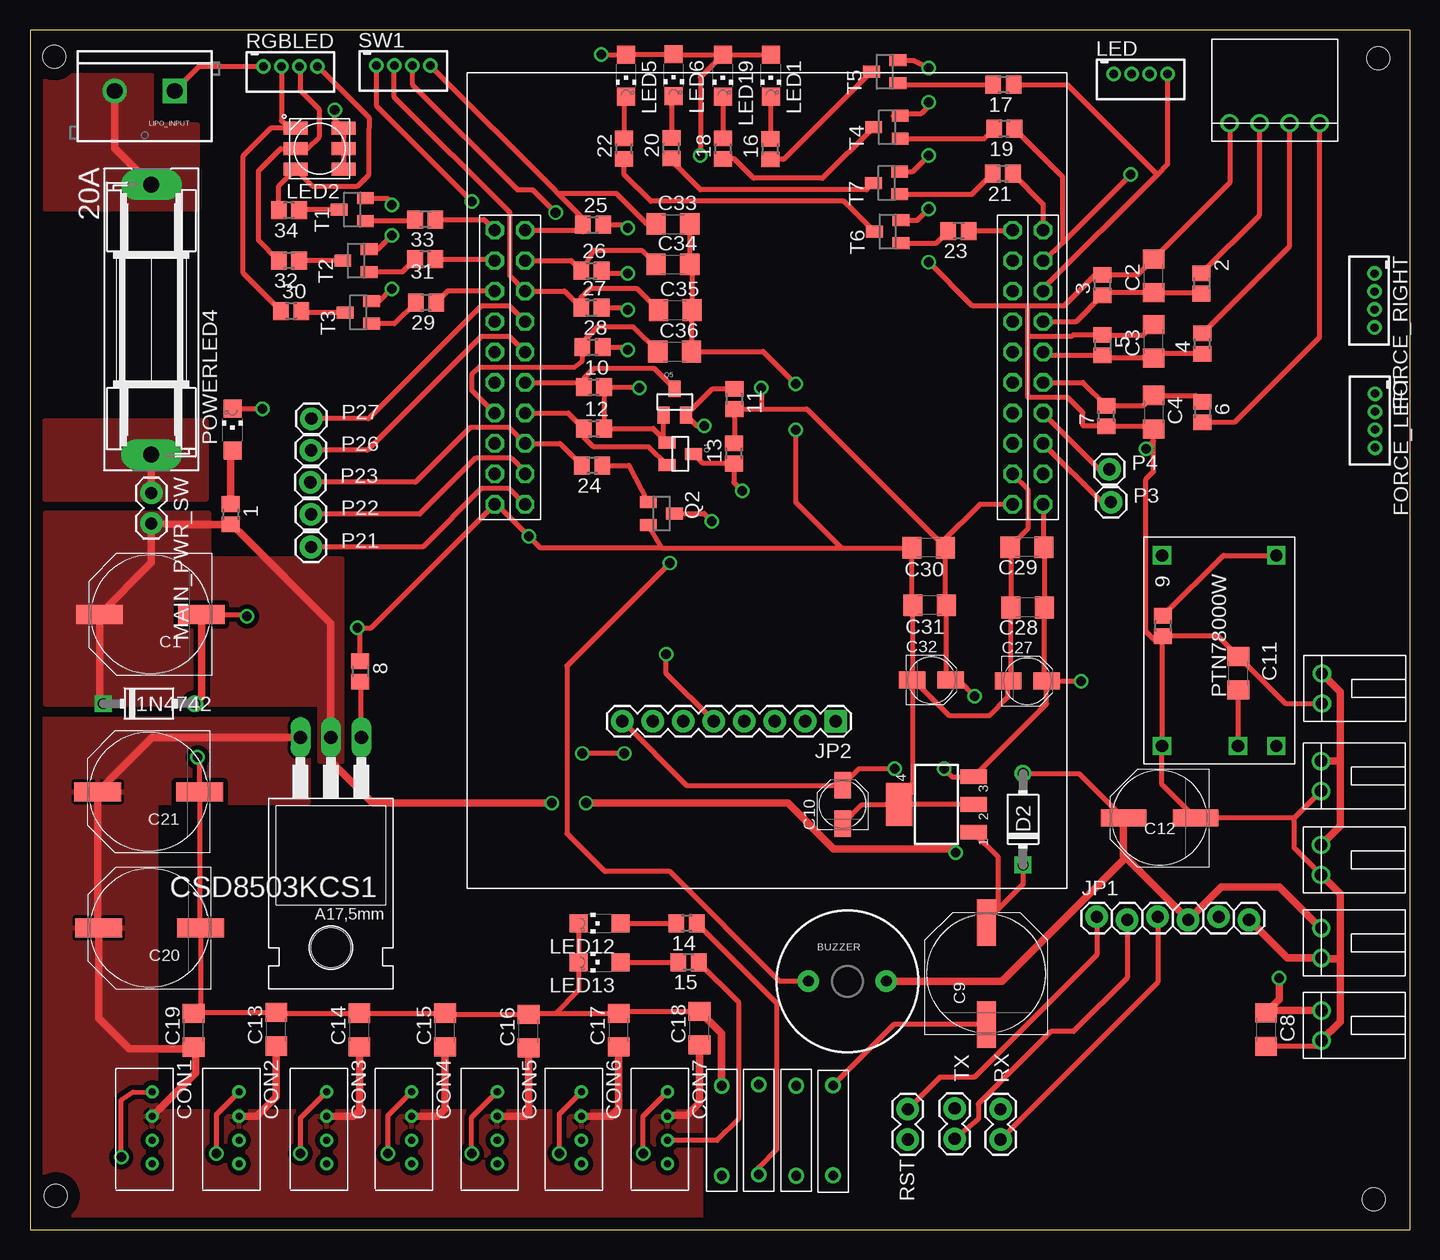
[diagram p10: board, top side]
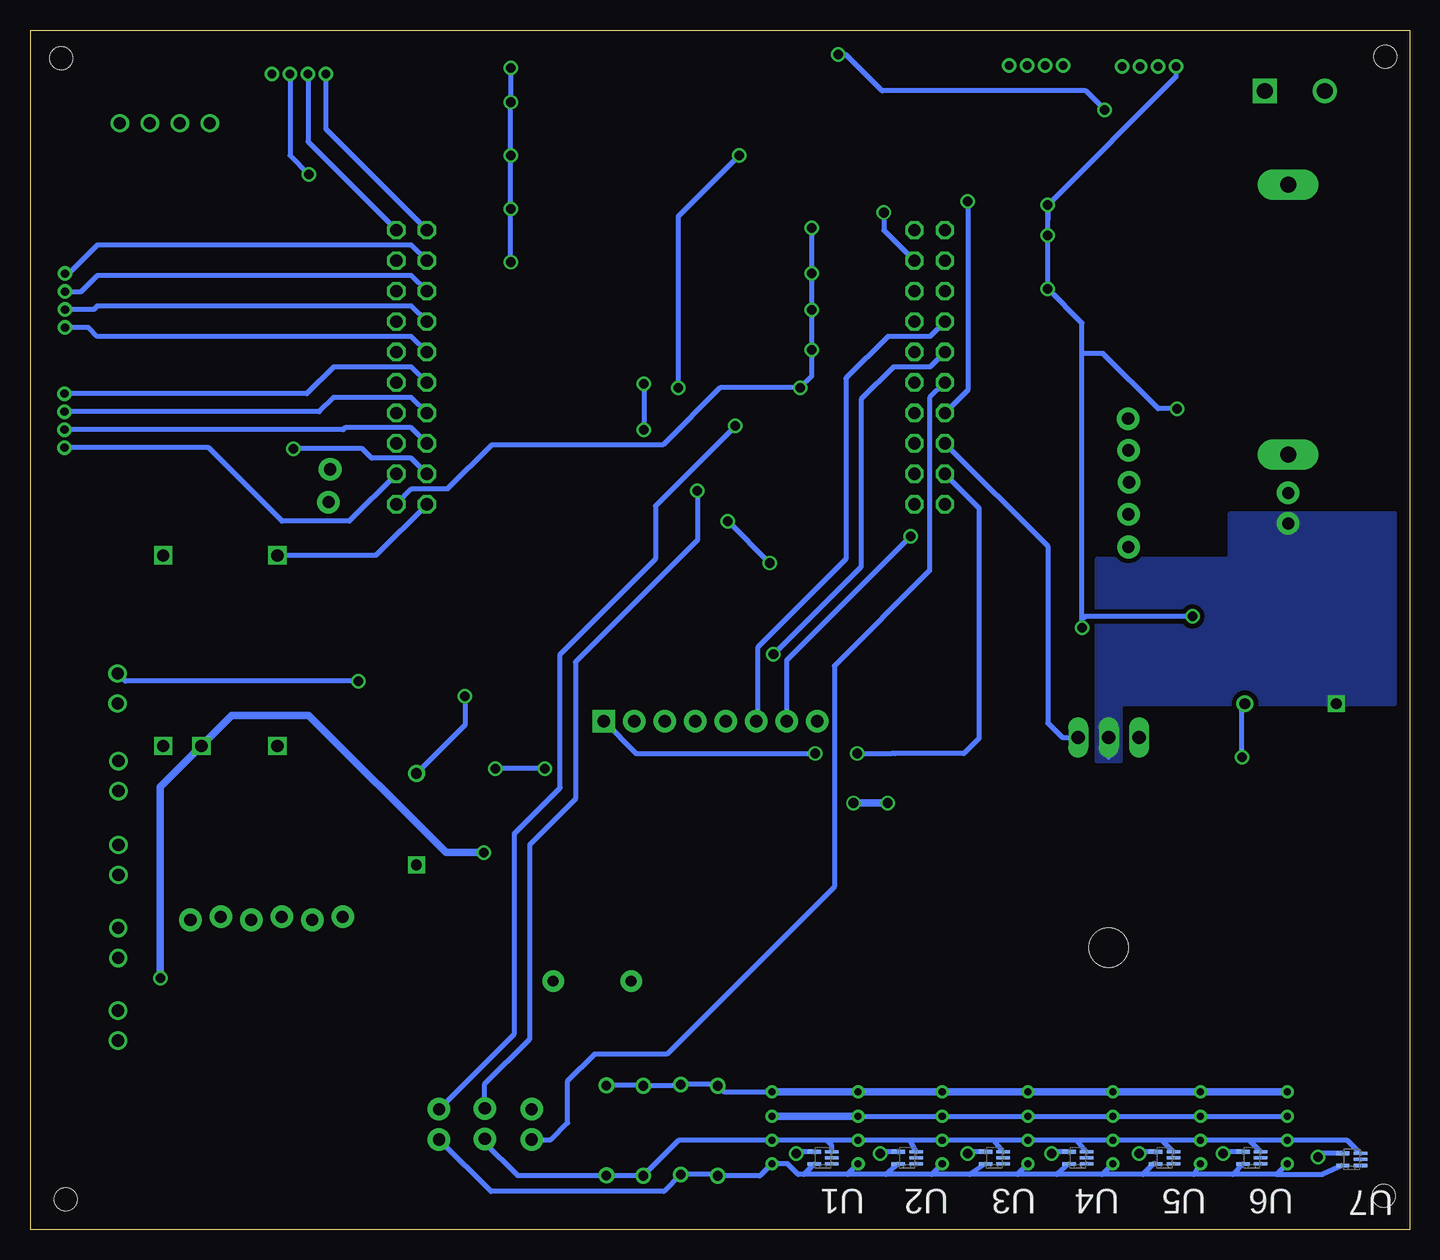
[diagram p11: board, bottom side, seen from below]

Size 115 x 100 mm. Coordinates in mm from the lower left corner, seen from the top.
Outline: 0,0 115,0 115,100 0,100 0,0
Copper layers (1*16): Top 0.035mm / dielectric 1.5mm / Bottom 0.035mm
Design rules "default *": minimum track width 0.4mm, minimum drill 0.8mm, track to track 0.4mm, track to pad 8mil, pad to pad 8mil, via to via 8mil, smd to smd 8mil, copper to edge 40mil, drill to drill 0.8mm, minimum pad ring 10mil, minimum via ring 8mil, stop-mask expansion 4mil, vias tented up to drill 0mil, thermal gap 10mil
Holes 1.9 mm at 2.03,97.79 112.39,97.66 2.16,2.79 112.01,2.54

### Footprints (pad centres in the part's own frame; a part is rotated, then mirrored left to right if it is on the bottom)
R0805 = smd 1.3 x 1.5: 1 -0.85,0; 2 0.85,0
DO41-3 = drill 0.9: A 3.81,0 | drill 0.9 square: C -3.81,0
2PINRIGHT = drill 1.02: P$1 0,0; P$2 2.5,0
SH22,5 = drill 1.321 pad 2.54 long: 1 -11.252,0; 2 11.252,0
BUZZER-12MM = drill 0.9 pad 1.778: + 3.25,0; - -3.25,0
PANASONIC_G = smd 3.9 x 1.6: + 4.25,0; - -4.25,0
C1206 = smd 1.6 x 1.8: 1 -1.4,0; 2 1.4,0
PANASONIC_B = smd 2.2 x 1.4: + 1.6,0; - -1.6,0
PANASONIC_E = smd 3.8 x 1.4: + 3,0; - -3,0
B4B-ZR = drill 0.6: 1 7.95,-1.75; 2 6,-1.75; 3 4,-1.75; 4 1.95,-1.75
TO220 = drill 1.118 long: 1 -2.54,-6.35; 2 0,-6.35; 3 2.54,-6.35 | hole 3.302: 0,11.176
B4B-ZR' = drill 0.7 pad 1.1: 1 -2.25,0; 2 -0.75,0; 3 0.75,0; 4 2.25,0
SOT223 = smd 1.219 x 2.235: 1 -2.311,-3.099; 2 0,-3.099; 3 2.311,-3.099 | smd 3.6 x 2.2: 4 0,3.099
1X06_LOCK = drill 1.016 pad 1.88: 1 0,0; 2 2.54,-0.254; 3 5.08,0; 4 7.62,-0.254; 5 10.16,0; 6 12.7,-0.254
1X08 = drill 1.016 pad 1.88 square: 1 0,0 | drill 1.016 pad 1.88: 2 2.54,0; 3 5.08,0; 4 7.62,0; 5 10.16,0; 6 12.7,0; 7 15.24,0; 8 17.78,0
CHIPLED_1206 = smd 1.5 x 1.5: A 0,-1.75; C 0,1.75
RGBLED5050 = smd 2 x 1.1: 1 -2,1.7; 2 -2,0; 3 -2,-1.7; 4 2,-1.7; 5 2,0; 6 2,1.7
SCREWTERMINAL-5MM-2 = drill 1.3 pad 2.032 square: 1 0,0 | drill 1.3 pad 2.032: 2 5,0
1X02 = drill 1.016 pad 1.88: 1 0,0; 2 2.54,0
1X01 = drill 1.016 pad 1.88: 1 0,0
SOT23 = smd 1 x 1.4: 1 -0.95,-1.1; 2 0.95,-1.1; 3 0,1.1
SOT50P160X60-5N = smd 1.118 x 0.254: 1 -0.737,0.508; 2 -0.737,0; 3 -0.737,-0.508 | smd 1.118 x 0.305: 4 0.737,-0.508; 5 0.737,0.508
TIVA = drill 1.02 octagon: P$1 0,0; P$2 2.54,0; P$3 5.08,0; P$4 7.62,0; P$5 10.16,0; P$6 12.7,0; P$7 15.24,0; P$8 17.78,0; P$9 20.32,0; P$10 22.86,0; P$11 0,2.54; P$12 2.54,2.54; P$13 5.08,2.54; P$14 7.62,2.54; P$15 10.16,2.54; P$16 12.7,2.54; P$17 15.24,2.54; P$18 17.78,2.54; P$19 20.32,2.54; P$20 22.86,2.54; P$21 0,43.18; P$22 2.54,43.18; P$23 5.08,43.18; P$24 7.62,43.18; P$25 10.16,43.18; P$26 12.7,43.18; P$27 15.24,43.18; P$28 17.78,43.18; P$29 20.32,43.18; P$30 22.86,43.18; P$31 0,45.72; P$32 2.54,45.72; P$33 5.08,45.72; P$34 7.62,45.72; P$35 10.16,45.72; P$36 12.7,45.72; P$37 15.24,45.72; P$38 17.78,45.72; P$39 20.32,45.72; P$40 22.86,45.72
4PINRIGHT = drill 1.02: P$1 0,0; P$2 2.5,0; P$3 5,0; P$4 7.5,0
PTN78000W = drill 1.02 square: P1 1.52,11.045; P2 1.52,4.705; P3 1.52,1.525; P4 17.4,1.52; P5 17.4,11.045
V18ZA2P = drill 0.8: P$1 0,0; P$2 7.5,0

### Placement (x,y rotation side)
1  16.73,59.63 270 top
1N4742  9.92,43.84 0 top
2  97.66,78.87 270 top
3  89.41,78.74 90 top
3.3V1  107.7,46.35 270 top
3.3VL  107.63,32.07 270 top
3.3VR  107.63,39.05 270 top
4  97.73,73.85 90 top
5  89.41,73.72 270 top
5V1  107.65,25.14 270 top
6  97.73,68.14 270 top
7  89.73,67.82 90 top
8  27.53,46.52 270 top
9  94.46,50.32 90 top
10  47,70.22 0 top
11  58.71,69.25 270 top
12  47,66.78 0 top
13  58.68,64.71 90 top
14  54.74,25.53 180 top
15  54.9,22.29 180 top
16  61.72,90.07 90 top
17  81.15,95.44 180 top
18  57.78,90.11 90 top
19  81.22,91.76 180 top
20  53.47,90.14 90 top
20A  10.11,75.85 270 top
21  81.09,88.01 180 top
22  49.53,90.11 90 top
23  77.41,83.25 180 top
24  46.86,63.69 180 top
25  46.93,83.76 0 top
26  46.8,79.95 0 top
27  46.8,76.83 0 top
28  46.9,73.56 0 top
29  33.02,77.28 180 top
30  21.78,76.58 0 top
31  32.96,80.9 180 top
32  21.59,80.77 180 top
33  32.96,84.2 180 top
34  21.59,84.96 180 top
BUZZER  68.14,20.7 0 top
C1  10.04,51.28 180 top
C2  93.66,79.5 90 top
C3  93.66,74.04 90 top
C4  93.66,68.14 270 top
C8  103.03,16.67 270 top
C9  79.72,21.34 90 top
C10  67.75,35.43 90 top
C11  100.73,46.37 90 top
C12  94.16,34.3 180 top
C13  20.53,16.69 90 top
C14  27.46,16.64 90 top
C15  34.61,16.64 90 top
C16  41.56,16.53 90 top
C17  49.08,16.63 90 top
C18  55.81,16.79 90 top
C19  13.65,16.61 90 top
C20  9.97,25.14 180 top
C21  9.89,36.49 180 top
C27  83.13,45.72 0 top
C28  83.16,51.85 180 top
C29  83.11,56.87 180 top
C30  74.92,56.83 180 top
C31  74.99,52.04 180 top
C32  75.15,45.81 0 top
C33  53.59,83.82 0 top
C34  53.59,80.45 0 top
C35  53.78,76.64 0 top
C36  53.73,73.19 0 top
CON1  11.94,13.43 270 top
CON2  19.18,13.43 270 top
CON3  26.48,13.43 270 top
CON4  33.56,13.43 270 top
CON5  40.7,13.43 270 top
CON6  47.72,13.43 270 top
CON7  54.9,13.43 270 top
CSD8503KCS1  25.08,34.67 180 top
D2  82.78,34.2 90 top
FITPC  107.66,18.26 270 top
FORCE_LEFT  B4B-ZR  [B4B-ZR']  112.14,67.44 270 top
FORCE_RIGHT  B4B-ZR  [B4B-ZR']  112.08,77.44 270 top
IC5  75.56,35.43 90 top
JP1  88.93,26.07 0 top
JP2  67.16,42.38 180 top
LED  B4B-ZR  [B4B-ZR']  92.58,96.33 0 top
LED1  61.75,96.2 180 top
LED2  24.13,90.11 180 top
LED5  49.69,96.2 180 top
LED6  53.66,96.23 180 top
LED12  47.5,25.53 90 top
LED13  47.5,22.29 90 top
LED19  57.75,96.2 180 top
LIPO_INPUT  12.06,94.93 180 top
MAIN_PWR_SW  10.11,61.4 270 top
P3  90.11,60.64 0 top
P4  89.98,63.37 0 top
P21  23.43,56.9 0 top
P22  23.43,59.63 0 top
P23  23.37,62.29 0 top
P26  23.43,64.96 0 top
P27  23.46,67.6 0 top
POWERLED4  16.88,66.67 0 top
Q1  54.21,64.66 270 top
Q2  52.64,59.69 270 top
Q5  53.75,68.99 0 top
RGBLED  B4B-ZR  [B4B-ZR']  21.72,96.96 0 top
RST  73.18,7.49 90 top
RX  80.9,10.03 270 top
SW1  B4B-ZR  [B4B-ZR']  31.11,97.03 0 top
T1  26.86,85.03 90 top
T2  27.18,80.77 90 top
T3  27.37,76.45 90 top
T4  71.44,91.88 90 top
T5  71.25,96.52 90 top
T6  71.5,83.19 90 top
T7  71.41,87.25 90 top
TX  77.09,10.1 270 top
U1  48.9,5.97 180 bottom
U2  41.88,5.97 180 bottom
U3  34.61,5.97 180 bottom
U4  27.65,5.97 180 bottom
U5  20.42,5.97 180 bottom
U6  13.14,5.97 180 bottom
U7  4.83,5.84 180 bottom
U$1  84.45,60.45 90 top
U$2  100.01,92.23 0 top
U$4  105.42,38.8 90 top
V8ZA2P-1  60.75,12.08 270 top
V8ZA2P-2  66.94,12.01 270 top
V8ZA2P-3  57.66,4.48 90 top
V8ZA2P-4  63.88,4.48 90 top

### Tracks (layer width: path | path; a pad name or v marks a point on that pad's centre or on a via)
3.3V  (via drill 0.8)
  Top 0.406: Q5.1 52.8,65.92 Q1.1 51.94,66.78 12.2 10.2 50.74,70.22 v50.8,70.17 | C27.+ 84.73,43.81 IC5.3 76.87,37.74 v76.2,38.42 | C27.+ 84.56,45.9 C28.1 84.56,56.82 C29.1 84.51,60.4 U$1.P$1 | JP2.8 54.73,37.03 C10.+ 69.14,38.42 v72.07,38.42 | C27.+ v87.63,45.72 | 25.2 49.59,83.76 v49.85,83.5 | v49.85,79.69 47.9,79.69 26.2 | 27.2 49.53,76.83 v49.85,76.68 | 28.2 49.47,73.56 v49.85,73.34
  Top 0.61: 3.3VL.P$1 109.22,33.66 109.22,39.05 | 3.3V1.P$1 109.22,44.83 109.22,39.05 | 3.3VR.P$1 109.22,39.05
  Bottom 0.406: v72.07,38.42 v76.2,38.42 | v87.63,45.72 107.06,45.72 3.3V1.P$1 | v49.85,83.5 v49.85,79.69 v49.85,76.68 v49.85,73.34 49.85,71.12 v50.8,70.17 57.47,70.17 62.23,65.41 76.52,65.41 80.17,61.75 83.19,61.75 84.45,60.48 U$1.P$1
5V  (via drill 0.8)
  Top 0.406: LED2.1 LED2.2 LED2.3 25.4,92.54 v25.4,93.34 | LED19.A 53.69,97.95 LED6.A 49.72,97.98 LED5.A 47.79,97.95 v47.62,97.95 | LED19.A LED1.A | 13.2 58.71,65.59 11.2 60.96,68.4 | 60.96,68.4 64.75,68.4 75.94,57.21 | 75.94,57.21 C30.1 76.32,52.12 C31.1 76.39,46.16 C32.+ 77.38,45.81 v78.74,44.45 | U$1.P$11 79.18,60.45 75.94,57.21 | 91.34,31.02 91.16,31.21 | D2.A 87.45,38.01 C12.+ | LED19.A 55.88,96.08 v55.88,89.53 | v60.96,70.17 60.96,68.4
  Top 0.61: BUZZER.+ 81.03,20.7 91.34,31.02 JP1.4 99.31,28.57 104.14,28.57 107.58,25.14 5V1.P$1 | C12.+ 91.16,31.21
  Bottom 0.406: v25.4,93.34 26.99,94.93 43.97,94.93 46.99,97.95 v47.62,97.95 | U$1.P$11 86.17,56.2 U$4.P5 | v78.74,44.45 78.74,42.05 D2.A | v55.88,89.53 60.96,84.45 v60.96,70.17
GND  (via drill 0.8)
  Top 0.406: CON1.4 8.57,11.45 7.62,10.79 v7.62,6.03 | v15.56,6.35 15.56,9.61 CON2.4 | v22.54,6.35 22.54,9.29 CON3.4 | v29.84,6.35 29.84,9.52 CON4.4 | v36.83,6.35 36.83,9.36 CON5.4 | v44.13,6.35 44.13,9.64 CON6.4 | v51.12,6.35 51.12,9.45 CON7.4 | 43.81,18.03 41.65,18.03 C16.2 34.71,17.93 C15.2 C14.2 20.58,18.04 C13.2 13.73,18.09 C19.2 14.22,18.58 C20.- 14.14,25.22 C21.- 14.14,39.2 v13.97,39.37 | 43.81,18.03 C17.2 49.24,18.19 C18.2 | LED12.C LED13.C 45.75,19.96 43.81,18.03 | C9.- 72.01,17.09 V8ZA2P-2.P$1 | LIPO_INPUT.1 14.1,96.97 RGBLED.1 | T1.2 29.78,85.98 v30.16,85.41 | 8.1 27.53,49.94 v27.3,50.16 28.45,50.16 U$1.P$31 38.92,60.45 v41.59,57.78 42.55,56.83 52.66,56.83 | C33.2 C34.2 55.18,80.26 C35.2 55.13,76.59 C36.2 61.11,73.19 v63.82,70.48 | C3.2 92.8,74.57 5.1 86.96,74.57 86.84,74.45 83.19,74.45 | C4.2 93.43,66.97 7.1 89.7,66.99 87.79,66.99 87.79,68.1 86.52,69.37 83.19,69.37 83.19,74.45 | U$2.P$1 100.01,87.25 C2.2 92.35,79.59 3.2 88.8,79.59 86.2,76.99 83.19,76.99 | FITPC.P$2 107.18,15.27 C8.2 | 107.86,22.64 5V1.P$2 | 3.3VR.P$2 105.39,34.3 | 105.39,34.3 C12.- 94.37,37.09 U$4.P1 94.37,49.39 9.1 | C10.- 69.36,35.43 IC5.4 | 73.59,45.86 C32.- 73.55,36.51 IC5.4 | 73.59,45.86 C31.2 73.52,52.12 C30.2 67.63,56.83 | IC5.2 IC5.4 | 9.1 99.03,49.47 C11.2 104.64,43.85 3.3V1.P$2 | v93.03,65.09 93.66,65.72 C4.2 | 73.59,45.86 76.59,42.86 80.01,42.86 81.53,44.39 C27.- 81.76,45.95 C28.2 81.76,56.82 C29.2 81.71,56.94 83.19,58.42 83.19,61.72 U$1.P$12 | 3.3VL.P$2 105.39,31.82 105.39,34.3 | C4.2 93.66,63.18 93.03,62.55 93.03,49.85 93.66,49.21 94.2,49.21 9.1 | 71.95,92.83 T4.2 72.73,93.03 74.3,93.03 74.93,93.66 v74.93,93.98
  Top 0.406: T5.2 73.66,97.47 v74.93,96.84 | T7.2 73.59,88.2 v74.93,89.53 | T6.2 73.97,84.14 v74.93,85.09 | 83.19,76.99 78.58,76.99 v74.93,80.64 | Q2.2 52.66,56.83 | 52.66,56.83 67.63,56.83 | 83.19,74.45 83.19,76.99 | v63.82,66.67 63.82,60.64 67.63,56.83 | T2.2 29.02,81.72 v30.16,82.87 | T3.2 29.14,77.4 v30.16,78.42 | C1.- 17.94,51.28 v18.1,51.12 | POWERLED4.C 19.21,68.42 v19.37,68.42
  Top 0.61: C1.- 14.29,44.4 1N4742.A | C18.2 57.66,16.34 V8ZA2P-3.P$2 | FITPC.P$2 109.22,17.31 109.22,22.54 | 3.3VL.P$2 109.22,27.98 109.22,22.54 | 107.86,22.64 107.95,22.54 109.22,22.54 | JP1.6 104.81,22.64 5V1.P$2
  Bottom 0.406: U6.4 15.43,6.48 v15.56,6.35 | U5.4 22.42,6.48 v22.54,6.35 | U4.4 29.72,6.48 v29.84,6.35 | U3.4 36.7,6.48 v36.83,6.35 | U2.4 44.01,6.48 v44.13,6.35 | U1.4 50.99,6.48 v51.12,6.35 | V8ZA2P-2.P$1 63.92,12.01 V8ZA2P-4.P$2 60.86,11.98 V8ZA2P-1.P$1 57.77,12.08 V8ZA2P-3.P$2 57.16,11.48 CON7.4 | v13.97,39.37 13.97,43.59 1N4742.A | v30.16,85.41 30.16,84.14 | RGBLED.1 19.47,96.1 v30.16,85.41 | U$1.P$12 83.22,64.29 86.52,64.29 87.31,65.09 v93.03,65.09 | U7.4 7.3,6.35 v7.62,6.03 | v74.93,96.84 v74.93,93.98 v74.93,89.53 v74.93,85.09 v74.93,80.64 | v63.82,70.48 v63.82,66.67 | v41.59,57.78 51.92,47.46 JP2.7 | v30.16,85.41 v30.16,82.87 v30.16,78.42 27.3,75.56 27.3,73.03 | v27.3,50.16 27.3,50.8 | 27.3,50.8 27.3,73.03 | v18.1,51.12 26.99,51.12 27.3,50.8 | v19.37,68.42 20.95,68.42 25.56,73.03 27.3,73.03
  Bottom 0.61: CON1.4 CON2.4 CON3.4 CON4.4 CON5.4 CON6.4 CON7.4
HX_RX
  Top 0.406: 14.1 62.23,18.88 62.23,6.67 60.75,5.19 V8ZA2P-1.P$2 | JP1.3 94.01,20.61 RX.2
  Bottom 0.406: 11.06,4.6 7.25,4.6 U7.5 | U6.5 14.74,4.6 | 17.07,5.48 CON2.1 17.99,4.6 | CON1.1 11.06,4.6 | 11.06,4.6 14.74,4.6 | 17.99,4.6 22.23,4.6 | 22.23,4.6 25.61,4.6 | U4.5 29.41,4.6 | U3.5 36.68,4.6 | U2.5 43.63,4.6 | 14.74,4.6 17.99,4.6 | CON3.1 25.61,4.6 | 25.61,4.6 29.41,4.6 | CON4.1 32.69,4.6 | 32.69,4.6 36.68,4.6 | 29.41,4.6 32.69,4.6 | CON5.1 39.83,4.6 | 39.83,4.6 43.63,4.6 | 36.68,4.6 39.83,4.6 | CON6.1 46.85,4.6 | 46.85,4.6 50.48,4.6 | 50.48,4.6 50.97,4.6 51.84,5.48 CON7.1 54.15,4.48 V8ZA2P-3.P$1 57.77,4.58 V8ZA2P-1.P$2 62.16,3.17 76.58,3.17 RX.2 | 43.63,4.6 46.85,4.6 | U1.5 50.48,4.6 | U5.5 21.37,5.46 22.23,4.6
HX_TX
  Top 0.406: 15.1 59.05,18.98 59.05,9.21 57.28,7.43 CON7.2 | JP1.2 91.47,20.99 87,16.51 85.09,16.51 79.06,10.48 79.06,9.21 TX.2
  Bottom 0.406: U6.3 13.36,7.43 | 13.36,7.43 CON2.2 20.64,7.43 | 20.64,7.43 CON3.2 27.71,7.43 | U4.3 27.71,7.43 | 27.71,7.43 CON4.2 34.66,7.43 | U3.3 34.66,7.43 | 34.66,7.43 CON5.2 41.62,7.43 | U2.3 41.62,7.43 | 41.62,7.43 CON6.2 48.58,7.43 | 48.58,7.43 CON7.2 60.93,7.43 V8ZA2P-4.P$1 66.9,4.48 V8ZA2P-2.P$2 74.36,4.51 77.09,7.24 TX.2 | 13.36,7.43 CON1.2 5.17,7.43 U7.3 | U1.3 48.16,7.01 48.58,7.43 | U5.3 20.64,7.43
LIPO_FB4
  Top 0.406: U$2.P$4 107.51,74.42 100.38,67.28 6.2
MOSFET_CTRL2
  Top 0.61: CSD8503KCS1.3 10.18,41.02 C21.+ 5.64,25.22 C20.+ 5.72,17.61 8.26,15.08 13.18,15.08 13.81,15.72 13.81,15.37 | 13.81,15.37 C19.1 | CON2.3 18.89,9.43 20.53,11.06 C13.1 | CON3.3 26.99,9.43 27.46,9.91 C14.1 | CON4.3 33.97,9.43 34.61,10.06 C15.1 | CON5.3 41.27,9.43 41.56,9.71 C16.1 | CON6.3 48.42,9.43 49.08,10.09 C17.1 | 13.81,15.37 13.81,13.05 CON1.3 | C18.1 55.81,10.57 54.77,9.53 53.24,9.53 CON7.3
  Bottom 0.406: CON1.3 CON2.3 CON3.3 CON4.3 CON5.3 CON6.3
  Bottom 0.61: CON7.3 CON6.3
  pour Top: 1.59,42.55 23.18,42.55 23.18,35.56 10.48,35.56 10.48,9.84 55.88,9.84 55.88,8.26 55.88,0.95 0.95,0.95 0.95,9.53 0.95,34.61 0.95,42.55
N$1
  Top 0.406: 30.1 17.78,79.73 17.78,89.53 20.05,91.81 21.59,91.81 | LED2.4 21.59,91.81 | RGBLED.2 20.97,92.43 21.59,91.81
N$2
  Top 0.406: JP1.1 88.93,22.89 78.74,12.7 75.85,12.7 RST.2
N$3
  Top 0.406: IC5.1 80.68,31.11 80.68,26.67 | 80.68,26.67 C9.+ | D2.C 82.78,28.78 80.68,26.67
N$4
  Top 0.406: 2.1 102.51,84.57 U$2.P$2
N$5
  Top 0.406: 32.2 19.05,82.46 19.05,88.27 20.89,90.11 LED2.5 23.11,90.11 24.13,91.12 24.13,93.34 22.54,94.93 22.54,96.89 RGBLED.3
N$9
  Top 0.61: 20A.2 MAIN_PWR_SW.1
  pour Top (no thermals): 1.27,67.31 14.61,67.31 14.61,60.96 1.27,60.96
N$14
  Top 0.61: LIPO_INPUT.2 7.07,90.15 20A.1
  pour Top (no thermals): 10.16,96.2 1.27,96.2 1.27,85.09 13.97,85.09 13.97,92.08 10.16,92.08
N$20  (via drill 0.8)
  Top 0.406: BUZZER.- 62.48,20.7 53.34,29.84 47.94,29.84 44.77,33.02 44.77,46.99 v53.34,55.56 | Q2.3 56.2,59.69 v56.83,59.05
  Bottom 0.406: v56.83,59.05 v53.34,55.56
N$21
  Top 0.406: 24.1 49.92,63.69 Q2.1
N$22
  Top 0.406: T4.1 79.54,90.93 19.2
N$24
  Top 0.406: LED19.C 57.78,94.42 18.2
N$25
  Top 0.406: T4.3 66.08,87.63 60.33,87.63 58.7,89.26 18.1
N$26
  Top 0.406: T5.1 72.48,95.44 17.2
N$27
  Top 0.406: 34.2 20.74,87.02 LED2.6 23.54,87 27.3,87 28.26,87.95 28.26,91.44 28.26,91.76 28.26,92.67 RGBLED.4
N$29
  Top 0.406: T3.3 22.76,76.45 30.2
N$30
  Top 0.406: T2.3 32.1
N$31
  Top 0.406: T1.3 22.5,85.03 34.1
N$32
  Top 0.406: LED1.C 61.72,94.42 16.2
N$33
  Top 0.406: T5.3 62.85,89.22 16.1
N$36
  Top 0.406: T6.1 75.54,82.23 23.2
N$37
  Top 0.406: 29.2 30.39,75.5 T3.1
N$38
  Top 0.406: 31.2 31.03,79.82 T2.1
N$39
  Top 0.406: 33.2 31.98,84.08 T1.1
N$40
  Top 0.406: LED5.C 49.53,94.29 22.2
N$41
  Top 0.406: T6.3 67.86,85.72 51.75,85.72 49.53,87.95 22.1
N$42
  Top 0.406: T7.1 78.53,86.3 21.2
N$43
  Top 0.406: LED6.C 53.47,94.29 20.2
N$44
  Top 0.406: T7.3 69.73,86.68 55.88,86.68 53.47,89.09 20.1
N$73
  Top 0.406: LED12.A 14.2
N$74
  Top 0.406: LED13.A 15.2
N$76
  Top 0.406: 9.2 99.48,56.2 U$4.P4
N$338
  Top 0.406: 4.2 105.01,81.99 U$2.P$3
N$381
  Top 0.61: 1.1 16.73,64.78 POWERLED4.A
P2
  Bottom 0.406: U$1.P$2 88.39,59.05 93.98,59.05 100.11,65.19 FORCE_LEFT.4
P3
  Top 0.406: U$1.P$3 89.34,60.64 P3.1
P4
  Top 0.406: U$1.P$4 89.15,63.37 P4.1
P5
  Top 0.406: 6.1 97.18,69.53 C4.1 92.8,68.67 7.2 87.78,70.61 U$1.P$5
P6
  Top 0.406: U$1.P$6 84.73,72.87 5.2 89.64,72.64 C3.1 94.02,73 4.1
P7
  Top 0.406: 2.2 97.58,78.1 C2.1 89.62,78.1 3.1 87.21,75.69 U$1.P$7
P8
  Top 0.406: U$1.P$8 84.45,78.42 93.98,87.95 | LED.4 94.83,88.8 93.98,87.95 | 17.1 86.49,95.44 93.98,87.95
P9  (via drill 0.8)
  Top 0.406: 19.1 86.04,87.78 86.04,82.23 | 86.04,82.23 84.58,80.77 U$1.P$9 | 86.04,82.23 v91.76,87.95
  Bottom 0.406: LED.3 93.33,89.52 v91.76,87.95
P10
  Top 0.406: 21.1 84.45,85.5 U$1.P$10
  Bottom 0.406: LED.2 91.83,90.69 U$1.P$10
P13
  Bottom 0.406: U$1.P$13 83.22,66.83 88.74,66.83 88.89,66.69 FORCE_LEFT.3
P14
  Bottom 0.406: U$1.P$14 83.22,69.37 89.69,69.37 90.88,68.19 FORCE_LEFT.2
P15
  Bottom 0.406: U$1.P$15 83.22,71.91 89.69,71.91 91.92,69.69 FORCE_LEFT.1
P16
  Bottom 0.406: U$1.P$16 83.22,74.45 109.38,74.45 110.11,75.19 FORCE_RIGHT.4
P17
  Bottom 0.406: U$1.P$17 83.22,76.99 109.38,76.99 109.68,76.69 FORCE_RIGHT.3
P18
  Bottom 0.406: U$1.P$18 83.22,79.53 109.38,79.53 110.72,78.19 FORCE_RIGHT.2
P19
  Bottom 0.406: U$1.P$19 83.22,82.07 109.38,82.07 111.76,79.69 FORCE_RIGHT.1
P20
  Top 0.406: U$1.P$20 81.85,83.25 23.1
  Bottom 0.406: U$1.P$20 90.33,91.73 LED.1
P21
  Top 0.406: U$1.P$21 39.97,61.75 37.62,61.75 32.77,56.9 P21.1
P22
  Top 0.406: U$1.P$22 41.27,63.15 40.13,64.29 37.15,64.29 32.48,59.63 P22.1
P23
  Top 0.406: 24.2 44.17,65.53 U$1.P$23 39.97,66.83 36.67,66.83 32.13,62.29 P23.1
P24
  Top 0.406: U$1.P$24 44.86,68.07 12.1 46.15,66.08 46.99,65.25 51.57,65.25 Q1.2
P25
  Top 0.406: U$1.P$25 45.77,70.61 10.1 46.15,70.92 46.99,71.75 52.08,71.75 Q5.3
P28
  Top 0.406: SW1.2 30.36,94.41 40.01,84.77 40.01,79.5 U$1.P$28 44.55,78.23 27.1 45.95,77.7 46.67,78.42 50.61,78.42 C35.1
P29  (via drill 0.8)
  Top 0.406: U$1.P$29 45.12,80.77 26.1 45.97,79.95 46.99,81.6 51.05,81.6 C34.1 | SW1.3 31.86,95.45 40.64,86.68 41.91,86.68 v43.81,84.77
  Bottom 0.406: v43.81,84.77 43.81,83.31 U$1.P$29
P30
  Top 0.406: U$1.P$30 45.63,83.31 25.1 | 25.1 46.08,83.15 | SW1.4 43.77,86.63 44.03,86.36 | 44.03,86.36 46.08,84.32 25.1 | C33.1 51.44,83.82 48.9,86.36 44.03,86.36
P32  (via drill 0.8)
  Top 0.406: v49.53,39.69 v46.04,39.69
  Bottom 0.406: U$1.P$32 35.88,60.13 35.88,40.96 37.15,39.69 42.86,39.69 43.18,39.69 v46.04,39.69 | JP2.1 64.47,39.69 v49.53,39.69
P33
  Top 0.406: CSD8503KCS1.1 27.62,45.58 8.2
  Bottom 0.406: U$1.P$33 30.16,56.96 30.16,42.23 28.96,41.02 CSD8503KCS1.1
P34  (via drill 0.8)
  Top 0.406: SW1.1 28.86,93.69 v36.83,85.72 | U$1.P$34 36.83,69.98 36.83,71.28 37.47,71.91 45.4,71.91 46.05,72.4 28.1 46.05,73.99 47.31,75.25 50.28,75.25 C36.1
  Bottom 0.406: v36.83,85.72 36.83,69.98 U$1.P$34
P35
  Bottom 0.406: U$1.P$35 40.01,69.34 40.01,54.93 47.94,46.99 47.94,28.57 61.91,14.61 67.94,14.61 70.17,12.38 70.17,8.89 71.56,7.49 RST.1
P36  (via drill 0.8)
  Top 0.406: JP2.5 53.02,46.36 v53.02,47.94
  Bottom 0.406: U$1.P$36 39.97,71.91 43.02,71.91 45.72,69.22 45.72,55.24 v53.02,47.94
P37
  Bottom 0.406: JP2.6 54.29,42.55 54.29,48.58 46.99,55.88 46.99,70.96 43.5,74.45 39.97,74.45 U$1.P$37
P38
  Top 0.406: U$1.P$38 34.82,78.23 29.1
P39
  Top 0.406: 31.1 38.61,80.9 U$1.P$39
P40
  Top 0.406: 33.1 37.85,84.2 U$1.P$40
RX3
  Top 0.406: P26.1 28.13,64.96 37.62,74.45 39.97,74.45 U$1.P$26
TIVA_RX  (via drill 0.8)
  Top 0.406: Q1.3 56.11,63.85 13.1 58.68,62.28 v59.37,61.59
  Bottom 0.406: v59.37,61.59 59.37,57.47 69.53,47.31 69.53,35.88 73.34,32.07 73.34,15.88 77.09,12.13 TX.1
TIVA_TX  (via drill 0.8)
  Top 0.406: 11.1 56.91,70.1 Q5.2 55.59,66.99 v56.2,66.99
  Bottom 0.406: RX.1 74.61,16.32 74.61,33.02 70.8,36.83 70.8,47.94 62.87,55.88 62.87,60.33 v56.2,66.99
TX3
  Top 0.406: P27.1 28.23,67.6 37.62,76.99 39.97,76.99 U$1.P$27
VCC  (via drill 0.8)
  Top 0.406: U$4.P2 100.73,40.33 C11.1
  Top 0.61: 1N4742.C 5.79,44.15 C1.+ 10.11,55.6 MAIN_PWR_SW.2 12.88,58.78 1.2 17.46,58.14 25.08,50.52 CSD8503KCS1.2 25.08,39.05 28.57,35.56 v43.5,35.56 | v46.35,35.56 63.18,35.56 66.99,31.75 76.83,31.75 v77.15,31.43 | FITPC.P$1 103.22,18.26 C8.1 104.14,19.18 v104.14,20.95
  Bottom 0.406: CSD8503KCS1.2 25.08,39.37
  Bottom 0.61: v43.5,35.56 v46.35,35.56 | v104.14,20.95 104.14,36.89 U$4.P2 98.17,42.86 91.76,42.86 80.33,31.43 v77.15,31.43
  pour Top (no thermals): 1.27,59.69 1.27,43.81 24.13,43.81 24.13,39.05 26.04,39.05 26.04,55.88 14.92,55.88 14.92,59.69
  pour Bottom (no thermals): 1.27,59.69 1.27,43.81 24.13,43.81 24.13,39.05 26.04,39.05 26.04,55.88 14.92,55.88 14.92,59.69